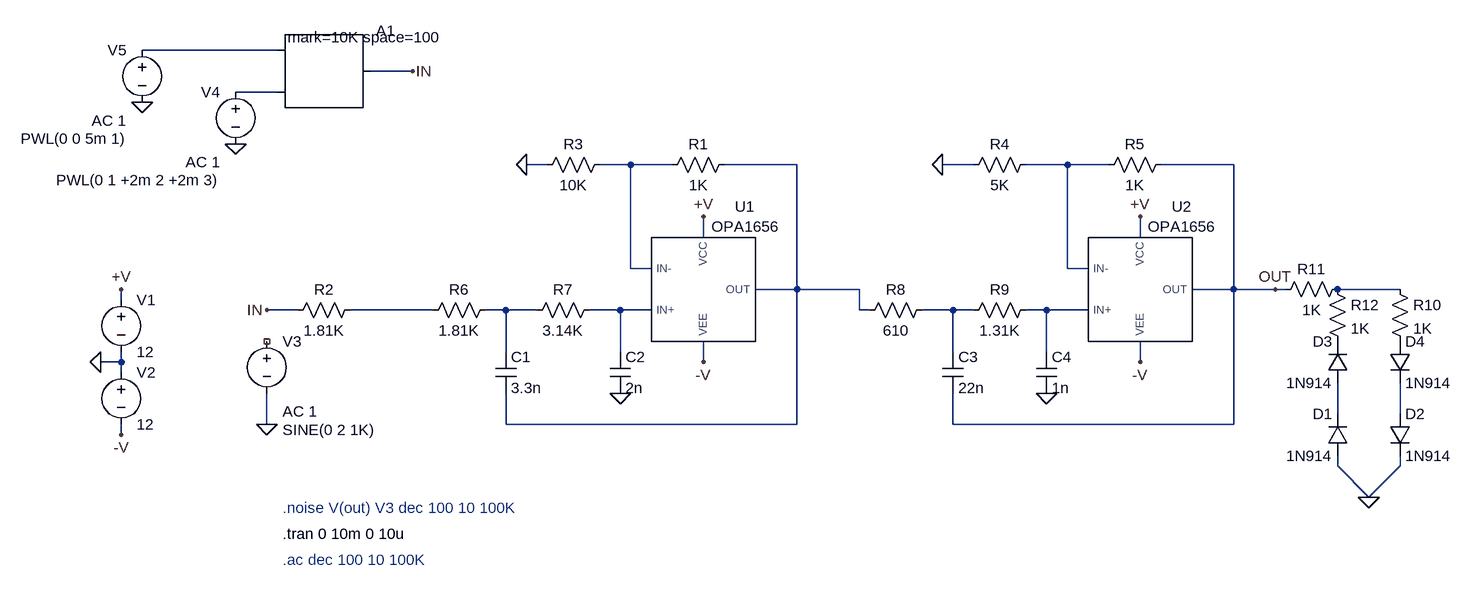
[diagram p0: schematic Draft18.asc]
Draft18.asc, the LTspice schematic file:
Version 4
SHEET 1 1908 680
WIRE -64 -208 -272 -208
WIRE 144 -176 80 -176
WIRE -64 -144 -128 -144
WIRE 352 -32 320 -32
WIRE 480 -32 432 -32
WIRE 544 -32 480 -32
WIRE 736 -32 624 -32
WIRE 1008 -32 960 -32
WIRE 1152 -32 1088 -32
WIRE 1216 -32 1152 -32
WIRE 1408 -32 1296 -32
WIRE 592 80 592 48
WIRE 1264 80 1264 48
WIRE 480 128 480 -32
WIRE 512 128 480 128
WIRE 1152 128 1152 -32
WIRE 1184 128 1152 128
WIRE 736 160 736 -32
WIRE 736 160 672 160
WIRE 832 160 736 160
WIRE 1408 160 1408 -32
WIRE 1408 160 1344 160
WIRE 1472 160 1408 160
WIRE 1488 160 1472 160
WIRE 1664 160 1568 160
WIRE -304 176 -304 160
WIRE -32 192 -80 192
WIRE 176 192 48 192
WIRE 288 192 256 192
WIRE 336 192 288 192
WIRE 464 192 416 192
WIRE 512 192 464 192
WIRE 832 192 832 160
WIRE 848 192 832 192
WIRE 976 192 928 192
WIRE 1008 192 976 192
WIRE 1120 192 1088 192
WIRE 1184 192 1120 192
WIRE 288 256 288 192
WIRE 464 256 464 192
WIRE 976 256 976 192
WIRE 1120 256 1120 192
WIRE -304 272 -304 256
WIRE -304 272 -336 272
WIRE 592 272 592 240
WIRE 1264 272 1264 240
WIRE -304 288 -304 272
WIRE 1568 352 1568 304
WIRE 1664 352 1664 304
WIRE -80 368 -80 320
WIRE 288 368 288 320
WIRE 736 368 736 160
WIRE 736 368 288 368
WIRE 976 368 976 320
WIRE 1408 368 1408 160
WIRE 1408 368 976 368
WIRE -304 384 -304 368
WIRE 1568 432 1568 416
WIRE 1664 432 1664 416
WIRE 1616 480 1568 432
WIRE 1616 480 1664 432
FLAG -336 272 0
FLAG -304 160 +V
FLAG -304 384 -V
FLAG 592 272 -V
FLAG 592 48 +V
FLAG -80 368 0
FLAG 1264 272 -V
FLAG 1264 48 +V
FLAG 1120 320 0
FLAG 464 320 0
FLAG -80 192 IN
FLAG 1472 160 OUT
FLAG 320 -32 0
FLAG 960 -32 0
FLAG 144 -176 IN
FLAG -272 -128 0
FLAG -128 -64 0
FLAG 1616 480 0
SYMBOL OPA1656 592 160 R0
SYMATTR InstName U1
SYMBOL voltage -304 160 R0
SYMATTR InstName V1
SYMATTR Value 12
SYMBOL voltage -304 272 R0
SYMATTR InstName V2
SYMATTR Value 12
SYMBOL voltage -80 224 R0
WINDOW 3 24 152 Left 2
WINDOW 123 24 124 Left 2
WINDOW 39 0 0 Left 0
SYMATTR Value SINE(0 2 1K)
SYMATTR Value2 AC 1
SYMATTR InstName V3
SYMBOL res 64 176 R90
WINDOW 0 0 56 VBottom 2
WINDOW 3 32 56 VTop 2
SYMATTR InstName R2
SYMATTR Value 1.81K
SYMBOL OPA1656 1264 160 R0
SYMATTR InstName U2
SYMBOL res 272 176 R90
WINDOW 0 0 56 VBottom 2
WINDOW 3 32 56 VTop 2
SYMATTR InstName R6
SYMATTR Value 1.81K
SYMBOL res 432 176 R90
WINDOW 0 0 56 VBottom 2
WINDOW 3 32 56 VTop 2
SYMATTR InstName R7
SYMATTR Value 3.14K
SYMBOL res 944 176 R90
WINDOW 0 0 56 VBottom 2
WINDOW 3 32 56 VTop 2
SYMATTR InstName R8
SYMATTR Value 610
SYMBOL res 1104 176 R90
WINDOW 0 0 56 VBottom 2
WINDOW 3 32 56 VTop 2
SYMATTR InstName R9
SYMATTR Value 1.31K
SYMBOL cap 272 256 R0
SYMATTR InstName C1
SYMATTR Value 3.3n
SYMBOL cap 448 256 R0
SYMATTR InstName C2
SYMATTR Value 2n
SYMBOL cap 960 256 R0
SYMATTR InstName C3
SYMATTR Value 22n
SYMBOL cap 1104 256 R0
SYMATTR InstName C4
SYMATTR Value 1n
SYMBOL res 640 -48 R90
WINDOW 0 0 56 VBottom 2
WINDOW 3 32 56 VTop 2
SYMATTR InstName R1
SYMATTR Value 1K
SYMBOL res 448 -48 R90
WINDOW 0 0 56 VBottom 2
WINDOW 3 32 56 VTop 2
SYMATTR InstName R3
SYMATTR Value 10K
SYMBOL diode 1584 416 R180
WINDOW 0 24 64 Left 2
WINDOW 3 24 0 Left 2
SYMATTR InstName D1
SYMATTR Value 1N914
SYMBOL diode 1648 352 R0
SYMATTR InstName D2
SYMATTR Value 1N914
SYMBOL res 1104 -48 R90
WINDOW 0 0 56 VBottom 2
WINDOW 3 32 56 VTop 2
SYMATTR InstName R4
SYMATTR Value 5K
SYMBOL res 1312 -48 R90
WINDOW 0 0 56 VBottom 2
WINDOW 3 32 56 VTop 2
SYMATTR InstName R5
SYMATTR Value 1K
SYMBOL SpecialFunctions\\modulate -64 -208 R0
WINDOW 3 16 -20 Left 2
SYMATTR InstName A1
SYMATTR Value mark=10K space=100
SYMBOL voltage -128 -160 M0
WINDOW 3 24 152 Left 2
WINDOW 123 24 124 Left 2
WINDOW 39 0 0 Left 0
SYMATTR Value PWL(0 1 +2m 2 +2m 3)
SYMATTR Value2 AC 1
SYMATTR InstName V4
SYMBOL voltage -272 -224 M0
WINDOW 3 24 152 Left 2
WINDOW 123 24 124 Left 2
WINDOW 39 0 0 Left 0
SYMATTR Value PWL(0 0 5m 1)
SYMATTR Value2 AC 1
SYMATTR InstName V5
SYMBOL diode 1584 304 R180
WINDOW 0 24 64 Left 2
WINDOW 3 24 0 Left 2
SYMATTR InstName D3
SYMATTR Value 1N914
SYMBOL diode 1648 240 R0
SYMATTR InstName D4
SYMATTR Value 1N914
SYMBOL res 1648 144 R0
SYMATTR InstName R10
SYMATTR Value 1K
SYMBOL res 1584 144 R90
WINDOW 0 0 56 VBottom 2
WINDOW 3 32 56 VTop 2
SYMATTR InstName R11
SYMATTR Value 1K
SYMBOL res 1552 144 R0
SYMATTR InstName R12
SYMATTR Value 1K
TEXT -56 536 Left 2 !.tran 0 10m 0 10u
TEXT -56 576 Left 2 ;.ac dec 100 10 100K
TEXT -56 496 Left 2 ;.noise V(out) V3 dec 100 10 100K

The netlist it stands for:
* Draft18.asc
XU1 N009 N003 +V -V N004 OPA1656  ; pins IN+ IN- VCC VEE OUT
V1 +V 0 12
V2 0 -V 12
V3 NC_01 0 SINE(0 2 1K) AC 1
R2 N007 IN 1.81K
XU2 N011 N005 +V -V OUT OPA1656  ; pins IN+ IN- VCC VEE OUT
R6 N008 N007 1.81K
R7 N009 N008 3.14K
R8 N010 N004 610
R9 N011 N010 1.31K
C1 N008 N004 3.3n
C2 N009 0 2n
C3 N010 OUT 22n
C4 N011 0 1n
R1 N004 N003 1K
R3 N003 0 10K
D1 0 N012 1N914
D2 N013 0 1N914
R4 N005 0 5K
R5 OUT N005 1K
A1 N001 N002 0 0 0 0 IN 0 MODULATOR mark=10K space=100
V4 N002 0 PWL(0 1 +2m 2 +2m 3) AC 1
V5 N001 0 PWL(0 0 5m 1) AC 1
D3 N012 P001 1N914
D4 P002 N013 1N914
R10 N006 P002 1K
R11 N006 OUT 1K
R12 N006 P001 1K
.model D D
.lib standard.dio
.tran 0 10m 0 10u
* .ac dec 100 10 100K
* .noise V(out) V3 dec 100 10 100K
.lib D:\git-repos\LTSpice-Projects\OPA165x\OPA1656.LIB
.backanno
.end